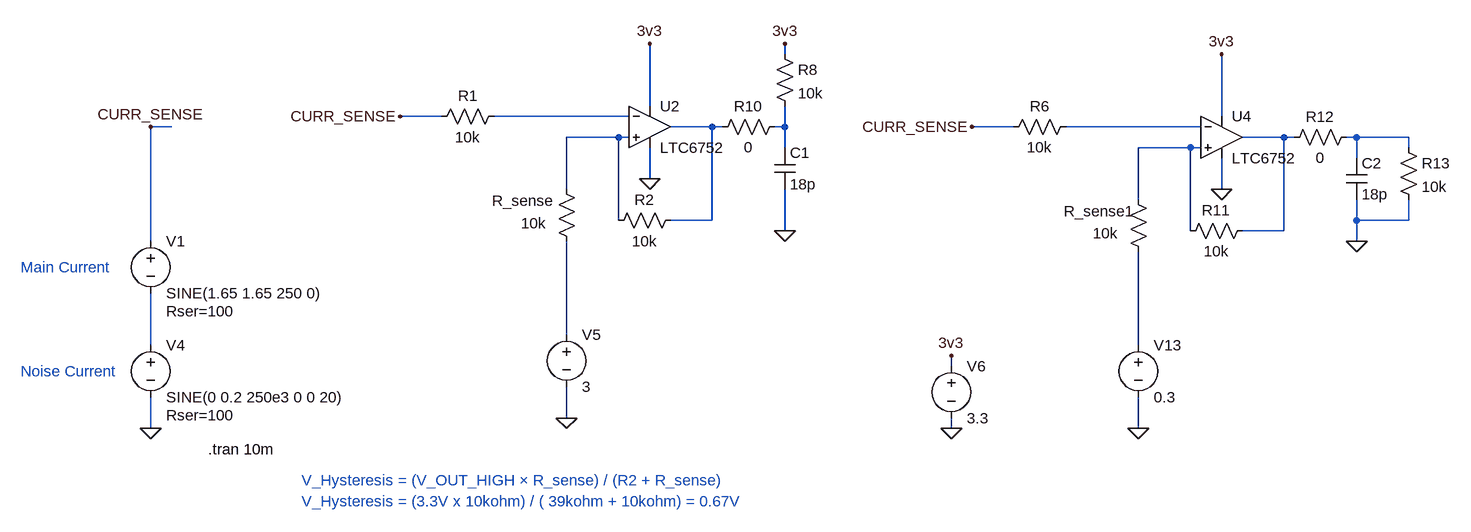
[diagram p0: schematic OCP.asc]
OCP.asc, the LTspice schematic file:
Version 4.1
SHEET 1 2312 1252
WIRE 704 -240 704 -256
WIRE 496 -160 496 -256
WIRE 176 -144 112 -144
WIRE 464 -144 256 -144
WIRE 1376 -144 1376 -240
WIRE -240 -128 -272 -128
WIRE 592 -128 528 -128
WIRE 608 -128 592 -128
WIRE 704 -128 704 -160
WIRE 704 -128 688 -128
WIRE 1056 -128 992 -128
WIRE 1344 -128 1136 -128
WIRE 448 -112 368 -112
WIRE 464 -112 448 -112
WIRE 1472 -112 1408 -112
WIRE 1488 -112 1472 -112
WIRE 1584 -112 1568 -112
WIRE 1664 -112 1584 -112
WIRE 704 -96 704 -128
WIRE 1328 -96 1248 -96
WIRE 1344 -96 1328 -96
WIRE 1664 -96 1664 -112
WIRE 1584 -80 1584 -112
WIRE 496 -48 496 -96
WIRE 368 -32 368 -112
WIRE 1376 -32 1376 -80
WIRE 1248 -16 1248 -96
WIRE 448 16 448 -112
WIRE 592 16 592 -128
WIRE 592 16 528 16
WIRE 1584 16 1584 -16
WIRE 1664 16 1664 -16
WIRE 1664 16 1584 16
WIRE 704 32 704 -32
WIRE 1328 32 1328 -96
WIRE 1472 32 1472 -112
WIRE 1472 32 1408 32
WIRE -272 48 -272 -128
WIRE 1584 48 1584 16
WIRE 368 192 368 48
WIRE -272 208 -272 128
WIRE 1248 208 1248 64
WIRE 960 240 960 224
WIRE 368 320 368 272
WIRE -272 336 -272 288
WIRE 960 336 960 320
WIRE 1248 336 1248 288
FLAG -272 336 0
FLAG 368 320 0
FLAG 496 -48 0
FLAG 960 336 0
FLAG 960 224 3v3
FLAG 496 -256 3v3
FLAG 704 32 0
FLAG 704 -256 3v3
FLAG 1248 336 0
FLAG 1376 -32 0
FLAG 1376 -240 3v3
FLAG 1584 48 0
FLAG -272 -128 CURR_SENSE
FLAG 112 -144 CURR_SENSE
FLAG 992 -128 CURR_SENSE
SYMBOL voltage -272 32 R0
WINDOW 123 0 0 Left 0
WINDOW 39 24 124 Left 2
SYMATTR InstName V1
SYMATTR Value SINE(1.65 1.65 250 0)
SYMATTR SpiceLine Rser=100
SYMBOL voltage -272 192 R0
WINDOW 123 0 0 Left 0
WINDOW 39 24 124 Left 2
SYMATTR InstName V4
SYMATTR Value SINE(0 0.2 250e3 0 0 20)
SYMATTR SpiceLine Rser=100
SYMBOL voltage 368 176 R0
WINDOW 123 0 0 Left 0
WINDOW 39 -109 114 Left 2
SYMATTR InstName V5
SYMATTR Value 3
SYMBOL voltage 960 224 R0
WINDOW 123 0 0 Left 0
WINDOW 39 0 0 Left 0
SYMATTR InstName V6
SYMATTR Value 3.3
SYMBOL Comparators\\LTC6752 496 -192 R0
SYMATTR InstName U2
SYMBOL res 272 -160 R90
WINDOW 0 0 56 VBottom 2
WINDOW 3 32 56 VTop 2
SYMATTR InstName R1
SYMATTR Value 10k
SYMBOL res 544 0 R90
WINDOW 0 0 56 VBottom 2
WINDOW 3 32 56 VTop 2
SYMATTR InstName R2
SYMATTR Value 10k
SYMBOL res 352 -48 R0
WINDOW 0 -99 34 Left 2
WINDOW 3 -54 68 Left 2
SYMATTR InstName R_sense
SYMATTR Value 10k
SYMBOL cap 688 -96 R0
SYMATTR InstName C1
SYMATTR Value 18p
SYMBOL res 704 -144 R90
WINDOW 0 0 56 VBottom 2
WINDOW 3 32 56 VTop 2
SYMATTR InstName R10
SYMATTR Value 0
SYMBOL res 688 -256 R0
SYMATTR InstName R8
SYMATTR Value 10k
SYMBOL voltage 1248 192 R0
WINDOW 123 0 0 Left 0
WINDOW 39 -109 114 Left 2
SYMATTR InstName V13
SYMATTR Value 0.3
SYMBOL Comparators\\LTC6752 1376 -176 R0
SYMATTR InstName U4
SYMBOL res 1152 -144 R90
WINDOW 0 0 56 VBottom 2
WINDOW 3 32 56 VTop 2
SYMATTR InstName R6
SYMATTR Value 10k
SYMBOL res 1424 16 R90
WINDOW 0 0 56 VBottom 2
WINDOW 3 32 56 VTop 2
SYMATTR InstName R11
SYMATTR Value 10k
SYMBOL res 1232 -32 R0
WINDOW 0 -99 34 Left 2
WINDOW 3 -54 68 Left 2
SYMATTR InstName R_sense1
SYMATTR Value 10k
SYMBOL cap 1568 -80 R0
SYMATTR InstName C2
SYMATTR Value 18p
SYMBOL res 1584 -128 R90
WINDOW 0 0 56 VBottom 2
WINDOW 3 32 56 VTop 2
SYMATTR InstName R12
SYMATTR Value 0
SYMBOL res 1648 -112 R0
SYMATTR InstName R13
SYMATTR Value 10k
TEXT -184 368 Left 2 !.tran 10m
TEXT -40 416 Left 2 ;V_Hysteresis = (V_OUT_HIGH × R_sense) / (R2 + R_sense)
TEXT -40 448 Left 2 ;V_Hysteresis = (3.3V x 10kohm) / ( 39kohm + 10kohm) = 0.67V
TEXT -472 88 Left 2 ;Main Current
TEXT -472 248 Left 2 ;Noise Current

The netlist it stands for:
* OCP.asc
V1 CURR_SENSE N010 SINE(1.65 1.65 250 0) Rser=100
V4 N010 0 SINE(0 0.2 250e3 0 0 20) Rser=100
V5 N009 0 3
V6 3v3 0 3.3
X§U2 N005 N001 3v3 0 N002 LTC6752  ; pins In+ In- V+ V- OUT
R1 N001 CURR_SENSE 10k
R2 N002 N005 10k
R_sense N005 N009 10k
C1 N003 0 18p
R10 N003 N002 0
R8 3v3 N003 10k
V13 N011 0 0.3
X§U4 N008 N004 3v3 0 N006 LTC6752  ; pins In+ In- V+ V- OUT
R6 N004 CURR_SENSE 10k
R11 N006 N008 10k
R_sense1 N008 N011 10k
C2 N007 0 18p
R12 N007 N006 0
R13 N007 0 10k
.tran 10m
* V_Hysteresis = (V_OUT_HIGH × R_sense) / (R2 + R_sense)
* V_Hysteresis = (3.3V x 10kohm) / ( 39kohm + 10kohm) = 0.67V
* Main Current
* Noise Current
.lib LTC7.lib
.backanno
.end